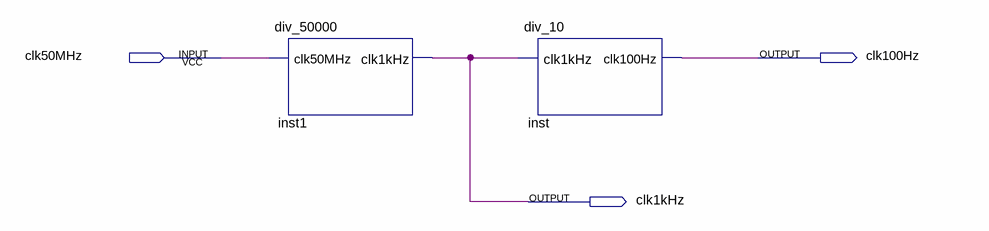
[diagram p0: schematic sheet]
// Quartus schematic clock.bdf as structural Verilog: 2 symbols, 3 pins
module clock (
  input  clk50MHz,
  output clk100Hz,
  output clk1kHz
);

  div_50000 inst1 (.clk50MHz(clk50MHz), .clk1kHz(clk1kHz));
  div_10 inst (.clk1kHz(clk1kHz), .clk100Hz(clk100Hz));
endmodule
